# EAGLE design TDT_CableTester (EAGLE 8.1.0)

## Sheet 1 of 3
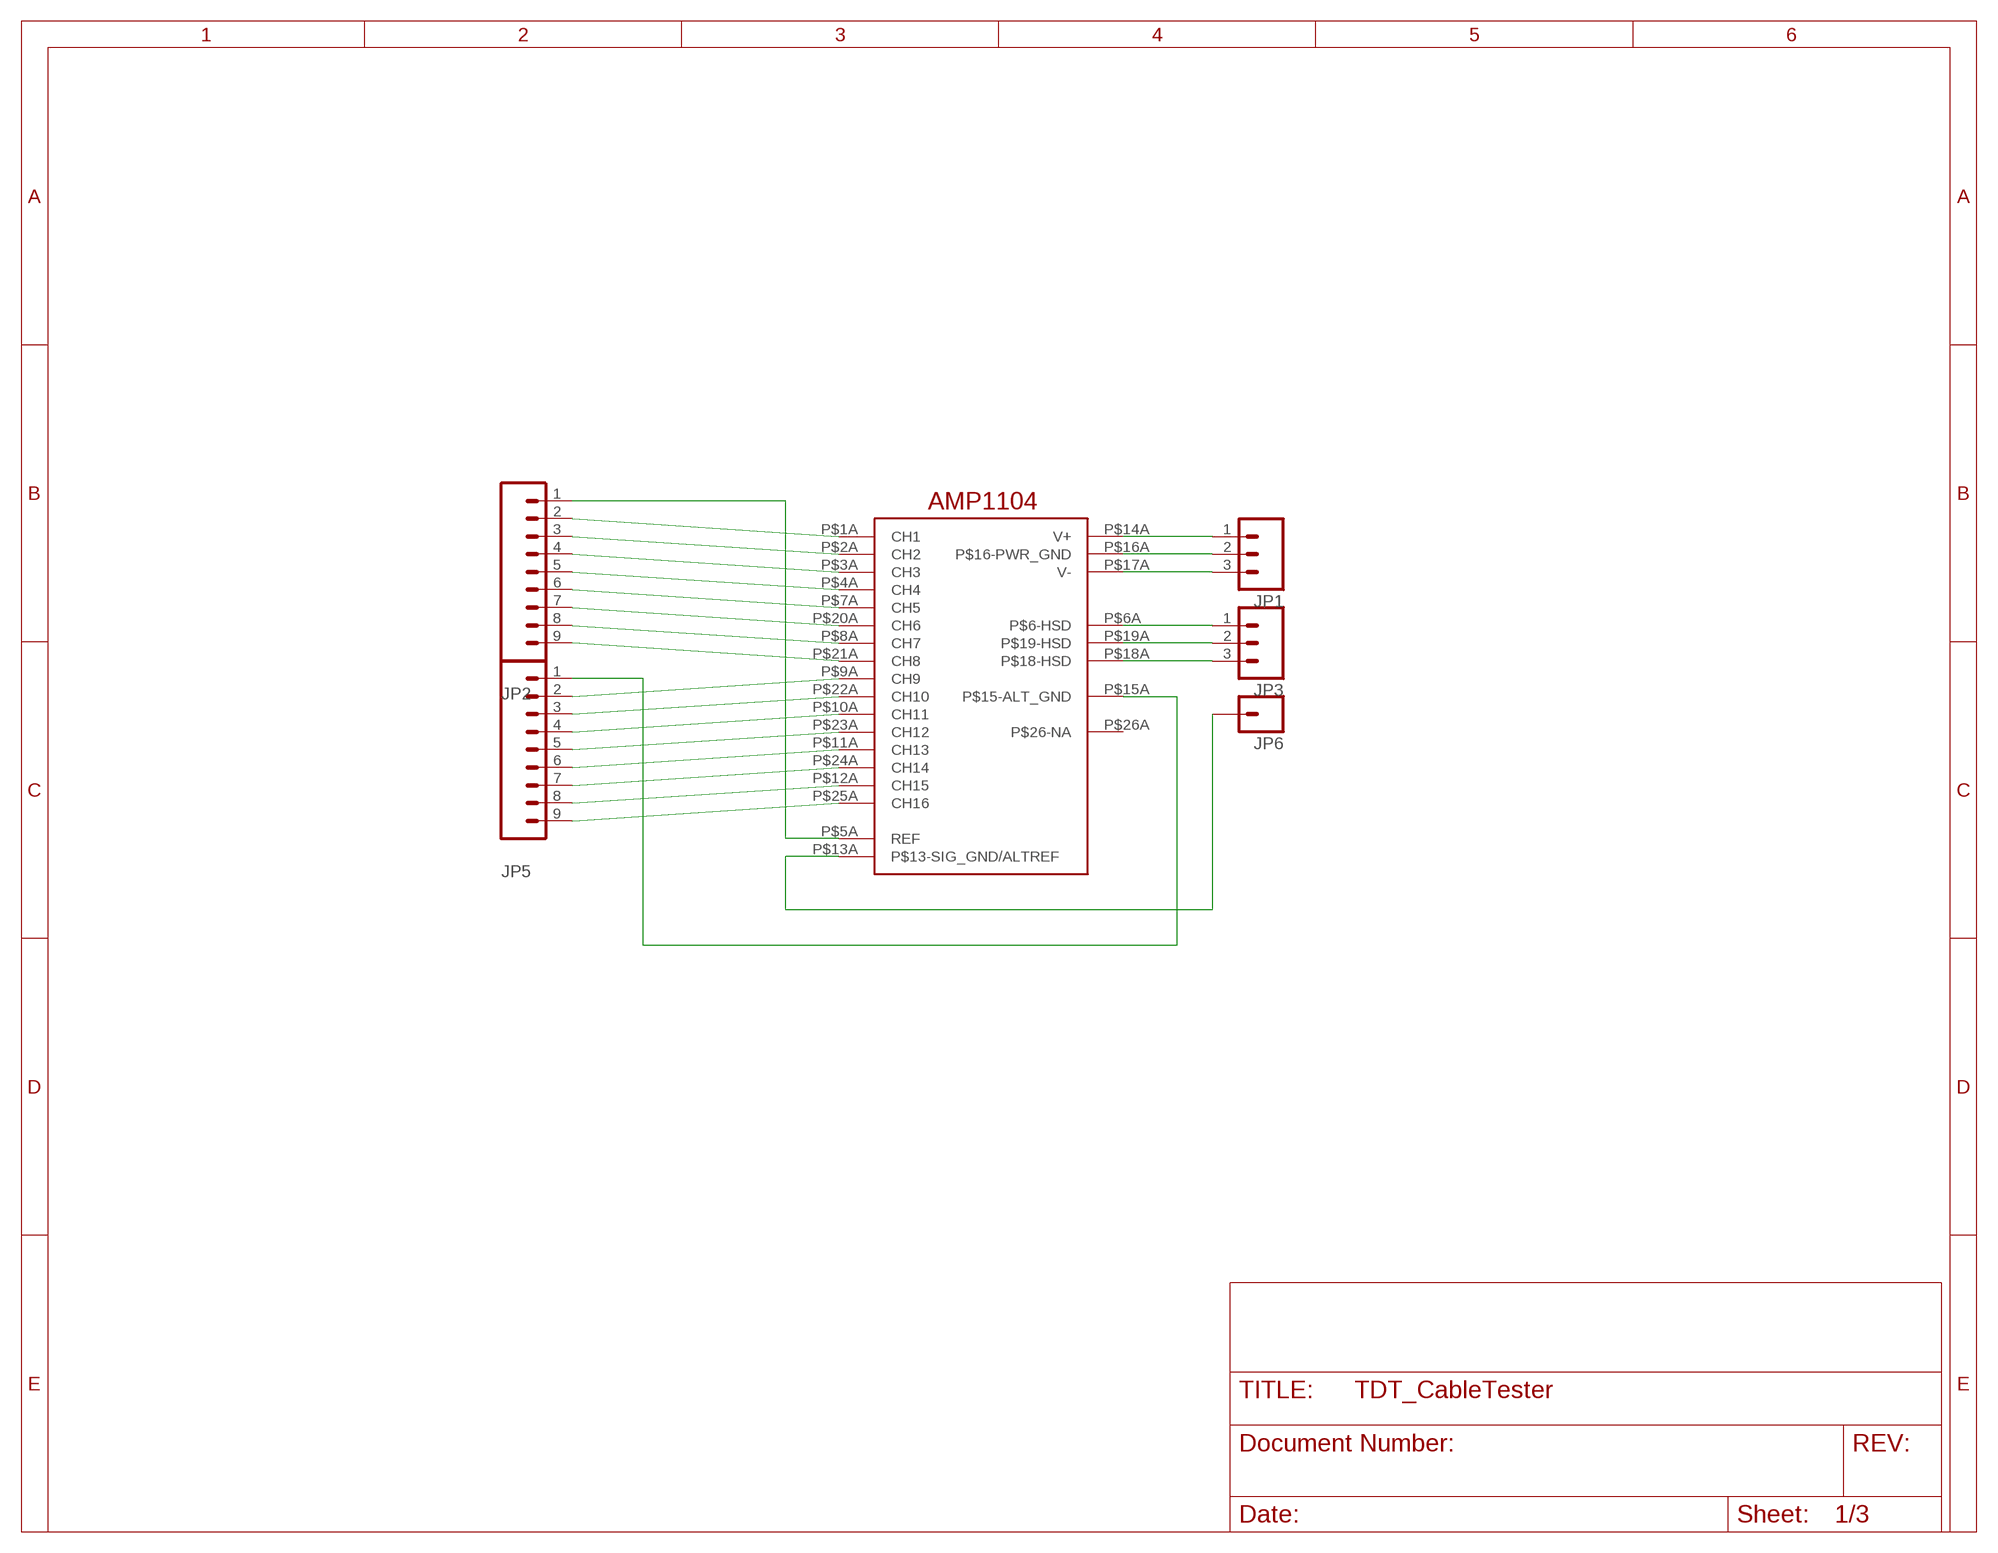
[diagram p0: schematic, sheet 1]

### Parts
JP1  M03PTH  [1X03]
JP2  M09  [1X09]
JP3  M03PTH  [1X03]
JP5  M09  [1X09]
JP6  M01PTH  [1X01]
U$3  AMP1104  [AMP1104]

### Nets
N$1: JP2.2 U$3.P$1A(CH1)
N$2: JP2.3 U$3.P$2A(CH2)
N$3: JP2.4 U$3.P$3A(CH3)
N$4: JP2.5 U$3.P$4A(CH4)
N$5: JP2.6 U$3.P$7A(CH5)
N$6: JP2.7 U$3.P$20A(CH6)
N$7: JP2.8 U$3.P$8A(CH7)
N$8: JP2.9 U$3.P$21A(CH8)
N$9: JP5.2 U$3.P$9A(CH9)
N$10: JP5.3 U$3.P$22A(CH10)
N$11: JP5.4 U$3.P$10A(CH11)
N$12: JP5.5 U$3.P$23A(CH12)
N$13: JP5.6 U$3.P$11A(CH13)
N$14: JP5.7 U$3.P$24A(CH14)
N$15: JP5.8 U$3.P$12A(CH15)
N$16: JP5.9 U$3.P$25A(CH16)
N$17: JP1.1 U$3.P$14A(V+)
N$18: JP1.2 U$3.P$16A(P$16-PWR_GND)
N$19: JP1.3 U$3.P$17A(V-)
N$20: JP5.1 U$3.P$15A(P$15-ALT_GND)
N$21: JP2.1 U$3.P$5A(REF)
N$22: JP6.1 U$3.P$13A(P$13-SIG_GND/ALTREF)
N$23: JP3.1 U$3.P$6A(P$6-HSD)
N$24: JP3.2 U$3.P$19A(P$19-HSD)
N$25: JP3.3 U$3.P$18A(P$18-HSD)
Unconnected: U$3.P$26A(P$26-NA)

## Sheet 2 of 3

## Sheet 3 of 3

## Library data of the parts
JP1 JP3 = SparkFun-Connectors:M03: Header 3 Standard 3-pin 0.1" header. Use with straight break away headers (SKU : PRT-00116), right angle break away headers (PRT-00553), swiss pins (PRT-00743), machine pins (PRT-00117), and female headers (PRT-00115). Molex polarized connector foot print use with SKU : PRT-08232 with associated crimp pins and housings.
JP2 JP5 = SparkFun-Connectors:M09: Header 9 Standard 9-pin 0.1" header. Use with straight break away headers (SKU : PRT-00116), right angle break away headers (PRT-00553), swiss pins (PRT-00743), machine pins (PRT-00117), and female headers (PRT-00115).
JP6 = SparkFun-Connectors:M01: Header 1 Standard 1-pin 0.1" header. Use with straight break away headers (SKU : PRT-00116), right angle break away headers (PRT-00553), swiss pins (PRT-00743), machine pins (PRT-00117), and female headers (PRT-00115).
U$3 = TDTCableConnector:AMP1104

## Board
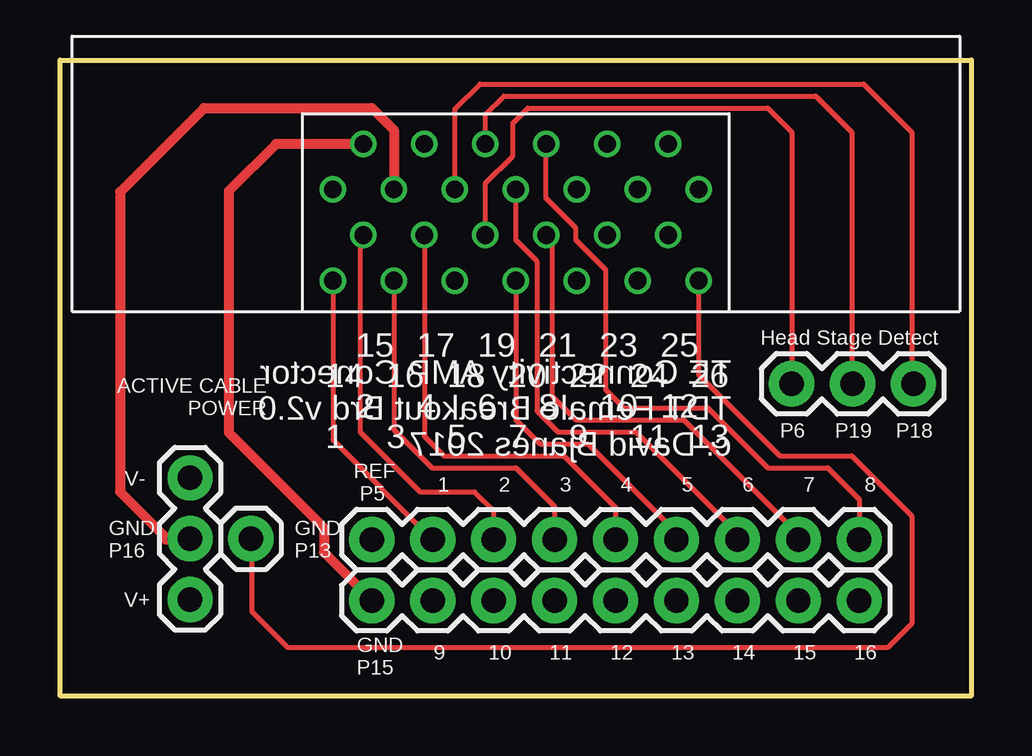
[diagram p1: board, top side]
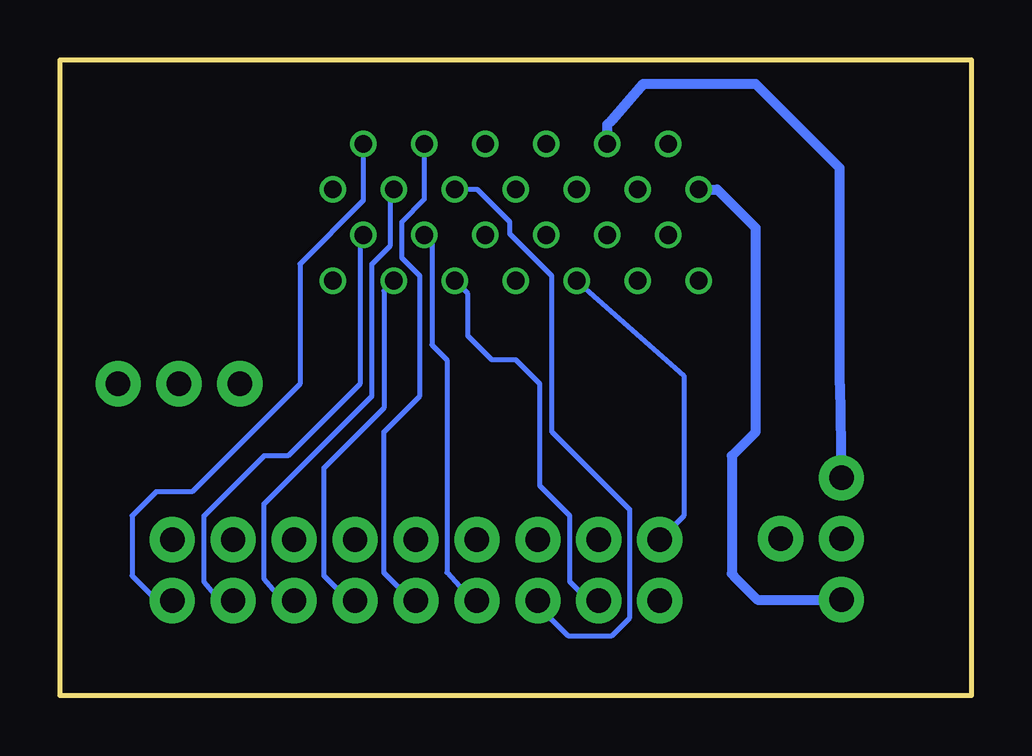
[diagram p2: board, bottom side, seen from below]

Size 38 x 26.5 mm. Coordinates in mm from the lower left corner, seen from the top.
Outline: 0,0 38,0 38,26.5 0,26.5 0,0
Copper layers (1*16): Top 0.0356mm / dielectric 1.5011mm / Bottom 0.0356mm
Design rules "oshpark-2layer": minimum track width 6mil, minimum drill 13mil, track to track 6mil, track to pad 6mil, pad to pad 6mil, via to via 6mil, smd to smd 6mil, copper to edge 15mil, drill to drill 6mil, minimum pad ring 7mil, minimum via ring 7mil, stop-mask expansion 2.5mil, vias tented up to drill 0mil, thermal gap 10mil

### Footprints (pad centres in the part's own frame; a part is rotated, then mirrored left to right if it is on the bottom)
1X03 = drill 1.016 pad 1.88: 1 0,0; 2 2.54,0; 3 5.08,0
1X09 = drill 1.016 pad 1.88: 1 0,0; 2 2.54,0; 3 5.08,0; 4 7.62,0; 5 10.16,0; 6 12.7,0; 7 15.24,0; 8 17.78,0; 9 20.32,0
1X01 = drill 1.016 pad 1.88: 1 0,0
AMP1104 = drill 0.737 pad 1.092: P$1A -7.62,-5.7; P$2A -6.35,-3.8; P$3A -5.08,-5.7; P$4A -3.81,-3.8; P$5A -2.54,-5.7; P$6A -1.27,-3.8; P$7A 0,-5.7; P$8A 1.27,-3.8; P$9A 2.54,-5.7; P$10A 3.81,-3.8; P$11A 5.08,-5.7; P$12A 6.35,-3.8; P$13A 7.62,-5.7; P$14A -7.62,-1.9; P$15A -6.35,0; P$16A -5.08,-1.9; P$17A -3.81,0; P$18A -2.54,-1.9; P$19A -1.27,0; P$20A 0,-1.9; P$21A 1.27,0; P$22A 2.54,-1.9; P$23A 3.81,0; P$24A 5.08,-1.9; P$25A 6.35,0; P$26A 7.62,-1.9

### Placement (x,y rotation side)
JP1  5.42,4 90 top
JP2  13,6.5 0 top
JP3  30.5,13 0 top
JP5  13,3.96 0 top
JP6  7.96,6.54 0 top
U$3  19,23 0 top

### Tracks (layer width: path | path; a pad name or v marks a point on that pad's centre or on a via)
N$1
  Top 0.203: U$3.P$1A 11.38,10.66 JP2.2
N$2
  Top 0.203: U$3.P$2A 12.5,19.05 12.5,11 15,8.5 17.29,8.5 18.08,7.71 JP2.3
N$3
  Top 0.203: U$3.P$3A 13.92,11.08 15.5,9.5 19,9.5 20.62,7.88 JP2.4
N$4
  Top 0.203: U$3.P$4A 15.19,10.81 16,10 21,10 23.16,7.84 JP2.5
N$5
  Top 0.203: U$3.P$7A 19,11.5 20,10.5 22,10.5 25.7,6.8 JP2.6
N$6
  Top 0.203: U$3.P$20A 19,19 19.88,18.12 19.88,11.88 20.75,11 24,11 28.24,6.76 JP2.7
N$7
  Top 0.203: U$3.P$8A 20.5,18.97 20.5,12.5 21.5,11.5 26,11.5 30.78,6.72 JP2.8
N$8
  Top 0.203: U$3.P$21A 20.25,22.98 20.25,20.75 21.5,19.5 21.5,19 22.75,17.75 22.75,12.75 23.5,12 27,12 29.5,9.5 32,9.5 33.32,8.18 JP2.9
N$9
  Bottom 0.203: U$3.P$9A 21,16.76 21,15 20,14 19,14 18,13 18,8.75 16.75,7.5 16.75,4.75 15.96,3.96 JP5.2
N$10
  Bottom 0.203: U$3.P$22A 20.6,21.1 19.25,19.75 19.25,19.25 17.5,17.5 17.5,11 14.25,7.75 14.25,3.25 15,2.5 16.83,2.5 18.08,3.75 JP5.3
N$11
  Bottom 0.203: U$3.P$10A 22.5,18.89 22.5,14.62 21.88,14 21.88,5.13 20.83,3.96 JP5.4
N$12
  Bottom 0.203: U$3.P$23A 22.81,20.69 23.75,19.75 23.75,18.25 23,17.5 23,12.5 24.5,11 24.5,5.12 23.34,3.96 JP5.5
N$13
  Bottom 0.203: U$3.P$11A 24.5,16.88 24.5,12 27,9.5 27,5 25.96,3.96 JP5.6
N$14
  Bottom 0.203: U$3.P$24A 24.25,20.93 24.25,18.75 25,18 25,12.5 29.5,8 29.5,4.88 28.71,3.96 JP5.7
N$15
  Bottom 0.203: U$3.P$12A 25.5,19.05 25.5,13 28.5,10 29.5,10 32,7.5 32,4.75 31.34,3.96 JP5.8
N$16
  Bottom 0.203: U$3.P$25A 25.35,20.65 28,18 28,13 32.5,8.5 34,8.5 35,7.5 35,5 34,4 33.57,4 33.53,3.96 JP5.9
N$17
  Bottom 0.203: 10,5.08 9.92,5
  Bottom 0.406: U$3.P$14A 10.6,21.1 9,19.5 9,11 10,10 10,5.08 | 9.92,5 8.92,4 JP1.1
N$18
  Top 0.406: JP1.2 5.38,6.5 4.5,6.5 | 4.5,6.5 4.42,6.5 | U$3.P$16A 13.92,23.58 13,24.5 6,24.5 2.5,21 2.5,8.5 4.5,6.5
N$19
  Bottom 0.406: U$3.P$17A 15.19,23.81 15,24 13.69,25.5 9,25.5 5.75,22.25 5.5,22 5.5,13 JP1.3
N$20
  Top 0.406: U$3.P$15A 9,23 7.04,21.04 7.04,10.96 11,7 11,5.96 JP5.1
N$21
  Bottom 0.203: U$3.P$5A 12,13.34 12,7.5 JP2.1
N$22
  Top 0.203: U$3.P$13A 26.62,13.38 30,10 33,10 35.5,7.5 35.5,3 34.5,2 9.5,2 8,3.5 8,6.5 JP6.1
N$23
  Top 0.203: U$3.P$6A 17.73,21.36 18.88,22.5 18.88,23.88 19.5,24.5 29.5,24.5 30.5,23.5 JP3.1
N$24
  Top 0.203: U$3.P$19A 17.73,24.23 18.5,25 31.5,25 33,23.5 33,13.54 JP3.2
N$25
  Top 0.203: U$3.P$18A 16.46,24.46 17.5,25.5 33.5,25.5 35.5,23.5 35.5,13.58 JP3.3

### Text on the board
tPlace: TE Connectivity AMP Conector / TDT Female Breakout Brd v2.0 / c. David Bjanes 2017
tNames: Head Stage Detect | ACTIVE CABLE / POWER | P6 | P19 | P18 | V- | REF / P5 | 1 | 2 | 3 | 4 | 5 | 6 | 7 | 8 | GND / P16 | GND / P13 | V+ | 9 | 10 | 11 | 12 | 13 | 14 | 15 | 16 | GND / P15